# EAGLE design USBtiny prefbrd (EAGLE 7.2.0)
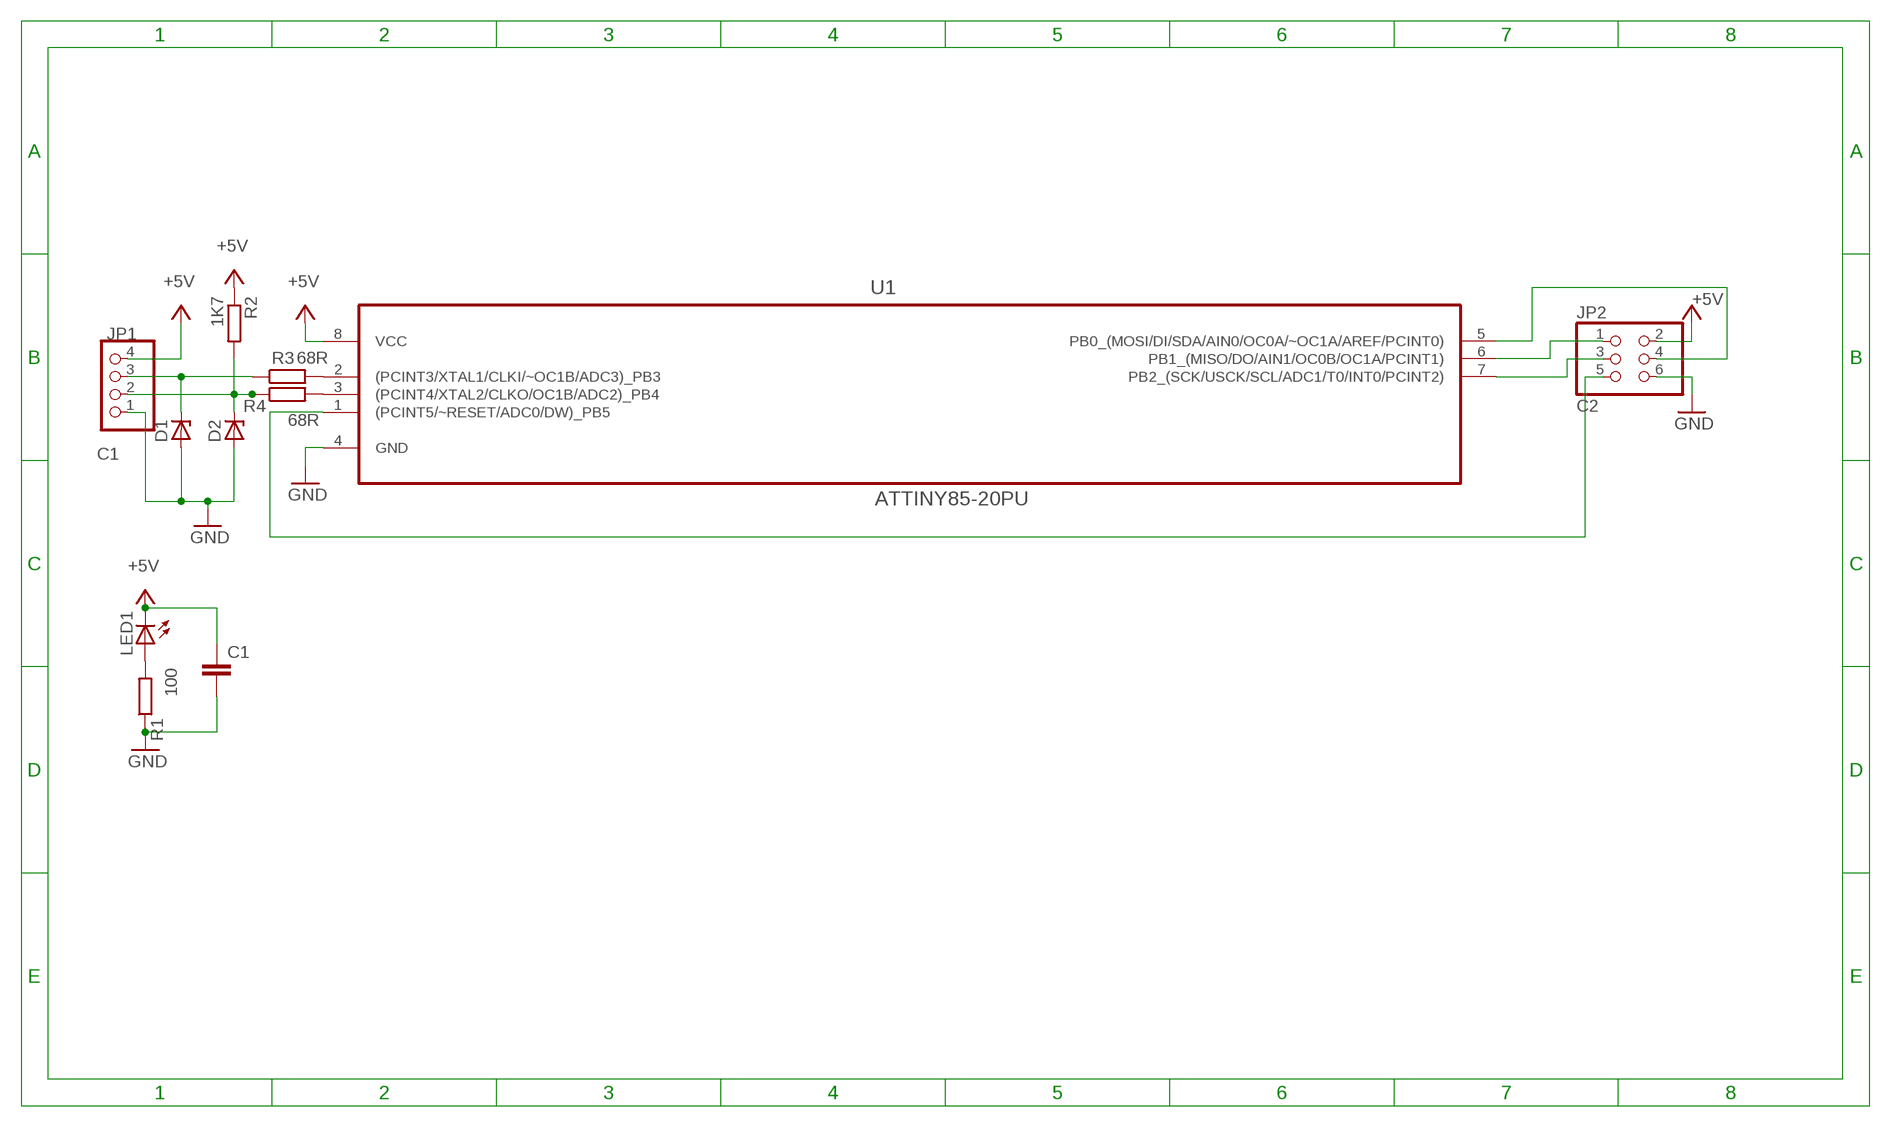
[diagram p0: schematic, sheet 1]

## Parts
C1  C2,5-3  [C2.5-3]
D1  1N4728  [DO41Z10]
D2  1N4728  [DO41Z10]
JP1  C1  PINHD-1X4  [1X04]
JP2  C2  PINHD-2X3  [2X03]
LED1  LED5MM  [LED5MM]
R1  100  R-EU_0207/10  [0207/10]
R2  1K7  R-EU_0207/10  [0207/10]
R3  68R  R-EU_0207/10  [0207/10]
R4  68R  R-EU_0207/10  [0207/10]
U1  ATTINY85-20PU  [DIP254P762X533-8]

## Nets
+5V: C1.1 JP1.4 JP2.2 LED1.K(C) R2.1 U1.8(VCC)
GND: C1.2 D1.A D2.A JP1.1 JP2.6 R1.1 U1.4(GND)
N$1: R3.2 U1.2((PCINT3/XTAL1/CLKI/~OC1B/ADC3)_PB3)
N$2: R4.2 U1.3((PCINT4/XTAL2/CLKO/OC1B/ADC2)_PB4)
N$3: D2.C JP1.2 R2.2 R4.1
N$4: D1.C JP1.3 R3.1
N$5: JP2.5 U1.1((PCINT5/~RESET/ADC0/DW)_PB5)
N$6: JP2.1 U1.6(PB1_(MISO/DO/AIN1/OC0B/OC1A/PCINT1))
N$7: JP2.3 U1.7(PB2_(SCK/USCK/SCL/ADC1/T0/INT0/PCINT2))
N$8: JP2.4 U1.5(PB0_(MOSI/DI/SDA/AIN0/OC0A/~OC1A/AREF/PCINT0))
N$9: LED1.A R1.2

## Library data of the parts
C1 = capacitor-wima:C: CAPACITOR naming: grid - package width
D1 D2 = diode:1N4728: Z DIODE 3.3 V, 1W, 5 percent
JP1 = pinhead:PINHD-1X4: PIN HEADER
JP2 = pinhead:PINHD-2X3: PIN HEADER
LED1 = led:LED: LED OSRAM: - CHIPLED LG R971, LG N971, LY N971, LG Q971, LY Q971, LO R971, LY R971 LH N974, LH R974 LS Q976, LO Q976, LY Q976 LO Q996 - Hyper CHIPLED LW Q18S LB Q993, LB Q99A, LB R99A - SideLED LS A670, LO A670, LY A670, LG A670, LP A670 LB A673, LV A673, LT A673, LW A673 LH A674 LY A675 LS A676, LA A676, LO A676, LY A676, LW A676 LS A679, LY A679, LG A679 - Hyper Micro SIDELED® LS Y876, LA Y876, LO Y876, LY Y876 LT Y87S - SmartLED LW L88C, LW L88S LB L89C, LB L89S, LG L890 LS L89K, LO L89K, LY L89K LS L896, LA L896, LO L896, LY L896 - TOPLED LS T670, LO T670, LY T670, LG T670, LP T670 LSG T670, LSP T670, LSY T670, LOP T670, LYG T670 LG T671, LOG T671, LSG T671 LB T673, LV T673, LT T673, LW T673 LH T674 LS T676, LA T676, LO T676, LY T676, LB T676, LH T676, LSB T676, LW T676 LB T67C, LV T67C, LT T67C, LS T67K, LO T67K, LY T67K, LW E67C LS E67B, LA E67B, LO E67B, LY E67B, LB E67C, LV E67C, LT E67C LW T67C LS T679, LY T679, LG T679 LS T770, LO T770, LY T770, LG T770, LP T770 LB T773, LV T773, LT T773, LW T773 LH T774 LS E675, LA E675, LY E675, LS T675 LS T776, LA T776, LO T776, LY T776, LB T776 LHGB T686 LT T68C, LB T68C - Hyper Mini TOPLED® LB M676 - Mini TOPLED Santana® LG M470 LS M47K, LO M47K, LY M47K Source: http://www.osram.convergy.de LUXEON: - LUMILED® LXK2-PW12-R00, LXK2-PW12-S00, LXK2-PW14-U00, LXK2-PW14-V00 LXK2-PM12-R00, LXK2-PM12-S00, LXK2-PM14-U00 LXK2-PE12-Q00, LXK2-PE12-R00, LXK2-PE12-S00, LXK2-PE14-T00, LXK2-PE14-U00 LXK2-PB12-K00, LXK2-PB12-L00, LXK2-PB12-M00, LXK2-PB14-N00, LXK2-PB14-P00, LXK2-PB14-Q00 LXK2-PR12-L00, LXK2-PR12-M00, LXK2-PR14-Q00, LXK2-PR14-R00 LXK2-PD12-Q00, LXK2-PD12-R00, LXK2-PD12-S00 LXK2-PH12-R00, LXK2-PH12-S00 LXK2-PL12-P00, LXK2-PL12-Q00, LXK2-PL12-R00 Source: www.luxeon.com KINGBRIGHT: KA-3528ASYC Source: www.kingbright.com
R1-R4 = rcl:R-EU_: RESISTOR, European symbol
U1 = Atmel_By_element14_Batch_1-00:ATTINY85-20PU: 8-bit Microcontroller with In-System Programmable Flash; MPN: ATTINY85-20PU; OC_FARNELL: 1455162; OC_NEWARK: 58M3796; PACKAGE: PDIP-8; SUPPLIER: Atmel

## Board
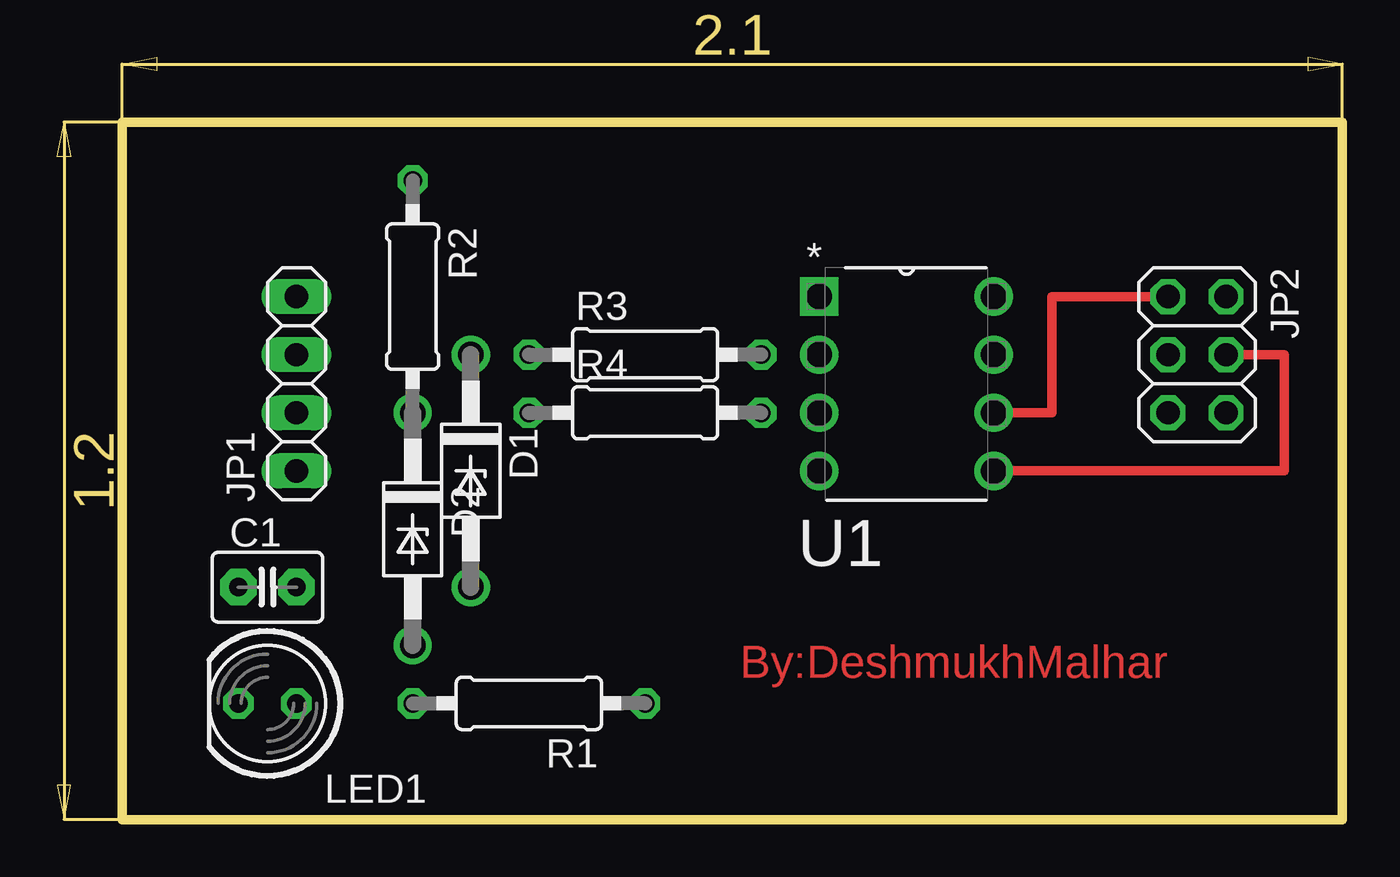
[diagram p1: board, top side]
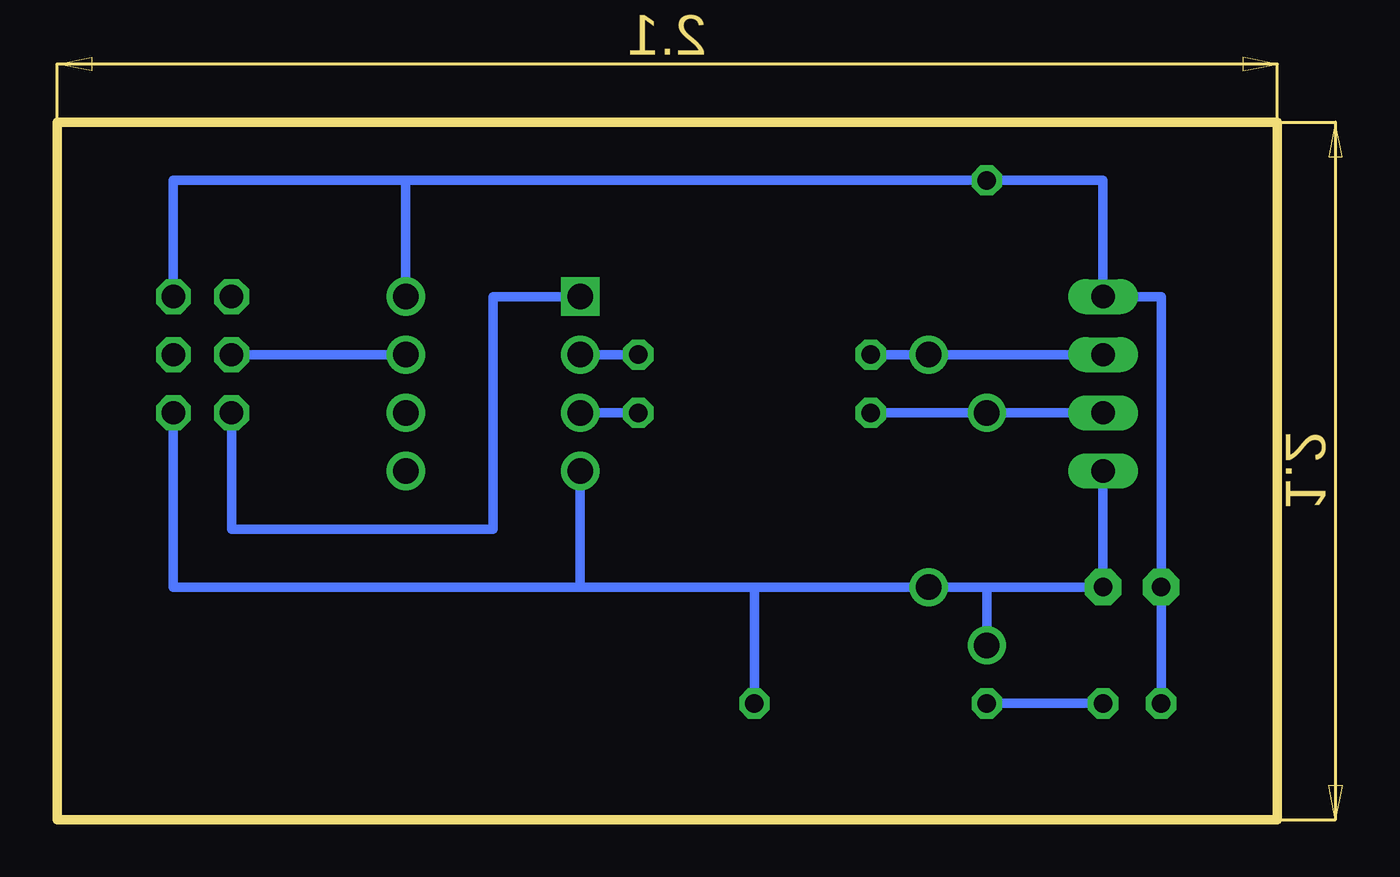
[diagram p2: board, bottom side, seen from below]

Size 53.34 x 30.48 mm. Coordinates in mm from the lower left corner, seen from the top.
Outline: 0,30.48 53.34,30.48 53.34,0 0,0 0,30.48
Copper layers (1*16): Top 0.035mm / dielectric 1.5mm / Bottom 0.035mm
Design rules "default": minimum track width 10mil, minimum drill 24mil, track to track 8mil, track to pad 8mil, pad to pad 8mil, via to via 8mil, smd to smd 8mil, copper to edge 40mil, drill to drill 8mil, minimum pad ring 10mil, minimum via ring 8mil, stop-mask expansion 4mil, vias tented up to drill 0mil, thermal gap 10mil

### Footprints (pad centres in the part's own frame; a part is rotated, then mirrored left to right if it is on the bottom)
C2.5-3 = drill 0.813 pad 1.6 octagon: 1 -1.27,0; 2 1.27,0
DO41Z10 = drill 1.118: A 5.08,0; C -5.08,0
1X04 = drill 1.016 long: 1 -3.81,0; 2 -1.27,0; 3 1.27,0; 4 3.81,0
2X03 = drill 1.016 octagon: 1 -2.54,-1.27; 2 -2.54,1.27; 3 0,-1.27; 4 0,1.27; 5 2.54,-1.27; 6 2.54,1.27
LED5MM = drill 0.813 octagon: A -1.27,0; K 1.27,0
0207/10 = drill 0.813 octagon: 1 -5.08,0; 2 5.08,0
DIP254P762X533-8 = drill 1.118 square: 1 -7.62,7.62 | drill 1.118: 2 -7.62,5.08; 3 -7.62,2.54; 4 -7.62,0; 5 0,0; 6 0,2.54; 7 0,5.08; 8 0,7.62

### Placement (x,y rotation side)
C1  6.35,10.16 0 top
D1  15.24,15.24 270 top
D2  12.7,12.7 270 top
JP1  7.62,19.05 90 top
JP2  46.99,20.32 270 top
LED1  6.35,5.08 180 top
R1  17.78,5.08 180 top
R2  12.7,22.86 270 top
R3  22.86,20.32 0 top
R4  22.86,17.78 0 top
U1  38.1,15.24 0 top

### Tracks (layer width: path | path; a pad name or v marks a point on that pad's centre or on a via)
+5V
  Bottom 0.406: LED1.K C1.1 5.08,22.86 JP1.4 7.62,27.94 R2.1 38.1,27.94 | JP2.2 48.26,27.94 38.1,27.94 | 38.1,27.94 U1.8
GND
  Bottom 0.406: 12.7,10.16 C1.2 JP1.1 | 12.7,10.16 D1.A 22.86,10.16 | D2.A 12.7,10.16 | 22.86,10.16 30.48,10.16 | 30.48,10.16 U1.4 | R1.1 22.86,10.16 | JP2.6 48.26,10.16 30.48,10.16
N$1
  Bottom 0.406: R3.2 U1.2
N$2
  Bottom 0.406: U1.3 R4.2
N$3
  Bottom 0.406: R4.1 R2.2 JP1.2
N$4
  Bottom 0.406: JP1.3 D1.C R3.1
N$5
  Bottom 0.406: JP2.5 45.72,12.7 34.29,12.7 34.29,22.86 U1.1
N$6
  Top 0.406: U1.6 40.64,17.78 40.64,22.86 JP2.1
N$7
  Bottom 0.406: U1.7 JP2.3
N$8
  Top 0.406: U1.5 50.8,15.24 50.8,20.32 JP2.4
N$9
  Bottom 0.406: LED1.A R1.2

### Text on the board
Top: By:DeshmukhMalhar